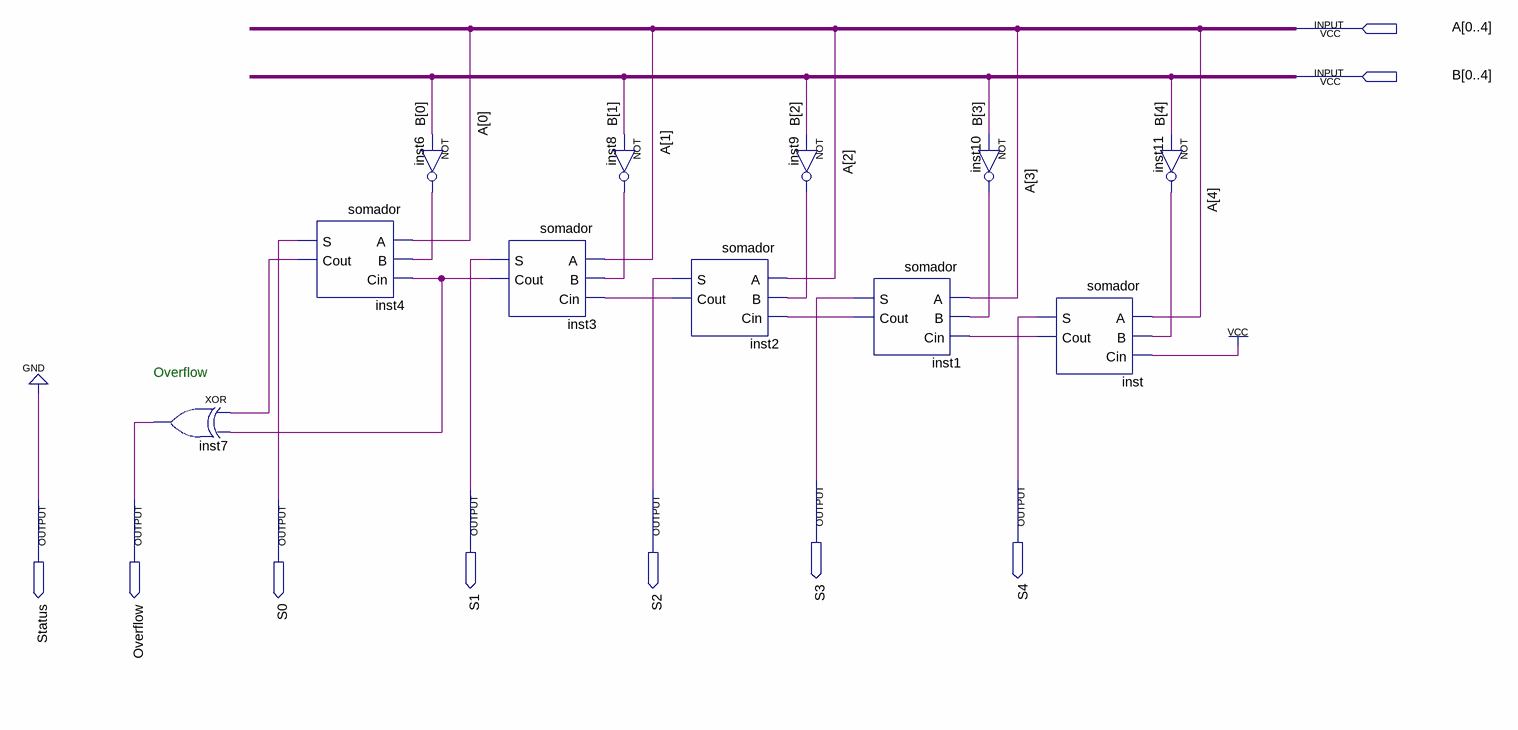
[diagram p0: schematic sheet]
// Quartus schematic subtrator-5bit.bdf as structural Verilog: 11 symbols, 9 pins
module \subtrator-5bit  (
  input  [0:4] A,
  input  [0:4] B,
  output S3,
  output S4,
  output S1,
  output S2,
  output Status,
  output Overflow,
  output S0
);

  wire inst1_cout, inst2_cout, inst3_cout, inst4_cout, inst6_out, inst8_out, inst9_out, inst10_out,
       inst11_out, inst_cout;

  xor inst7 (Overflow, inst4_cout, inst3_cout);
  somador inst4 (.A(A[0]), .B(inst6_out), .Cin(inst3_cout), .S(S0), .Cout(inst4_cout));
  not inst6 (inst6_out, B[0]);
  somador inst3 (.A(A[1]), .B(inst8_out), .Cin(inst2_cout), .S(S1), .Cout(inst3_cout));
  not inst8 (inst8_out, B[1]);
  somador inst2 (.A(A[2]), .B(inst9_out), .Cin(inst1_cout), .S(S2), .Cout(inst2_cout));
  not inst9 (inst9_out, B[2]);
  somador inst1 (.A(A[3]), .B(inst10_out), .Cin(inst_cout), .S(S3), .Cout(inst1_cout));
  not inst10 (inst10_out, B[3]);
  somador inst (.A(A[4]), .B(inst11_out), .Cin(1'b1), .S(S4), .Cout(inst_cout));
  not inst11 (inst11_out, B[4]);

  assign Status = 1'b0;

  // Notes on the sheet:
  //   Overflow
endmodule
